# EAGLE design sondeSide (EAGLE 9.1.2)
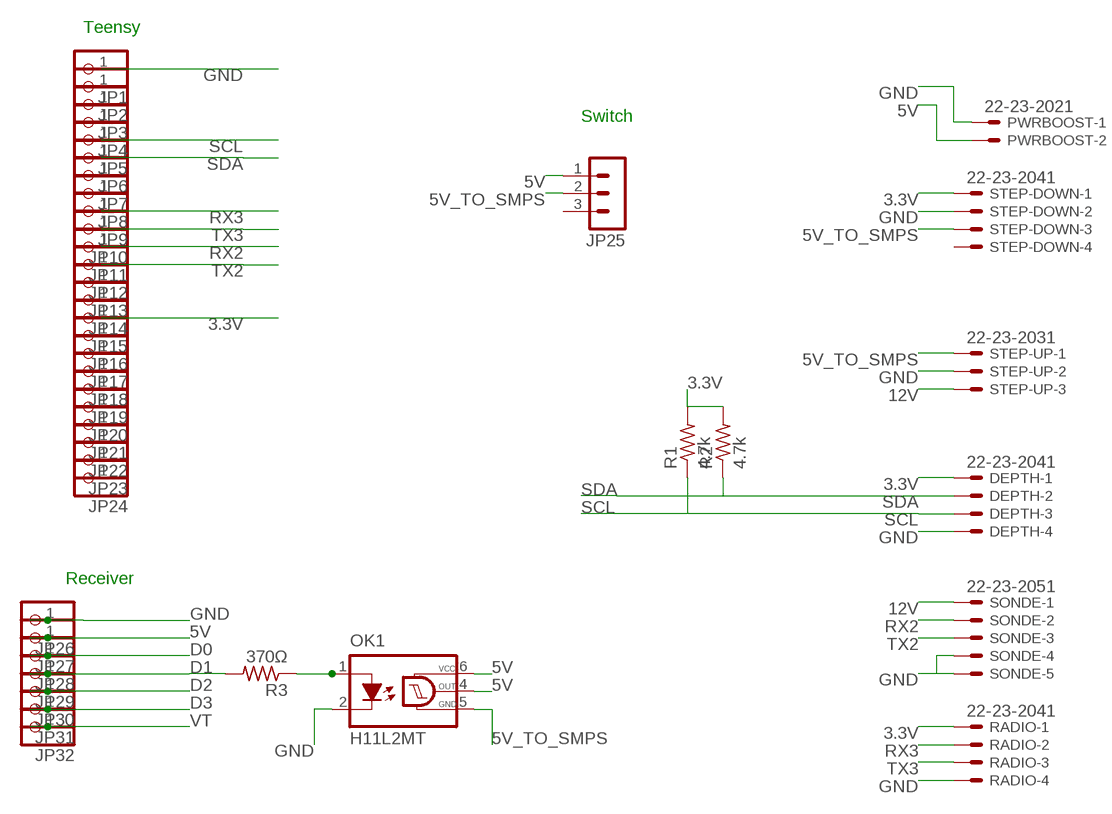
[diagram p0: schematic, sheet 1]

## Parts
DEPTH  22-23-2041  [22-23-2041]
JP1  PINHD-1X1  [1X01]
JP2  PINHD-1X1  [1X01]
JP3  PINHD-1X1  [1X01]
JP4  PINHD-1X1  [1X01]
JP5  PINHD-1X1  [1X01]
JP6  PINHD-1X1  [1X01]
JP7  PINHD-1X1  [1X01]
JP8  PINHD-1X1  [1X01]
JP9  PINHD-1X1  [1X01]
JP10  PINHD-1X1  [1X01]
JP11  PINHD-1X1  [1X01]
JP12  PINHD-1X1  [1X01]
JP13  PINHD-1X1  [1X01]
JP14  PINHD-1X1  [1X01]
JP15  PINHD-1X1  [1X01]
JP16  PINHD-1X1  [1X01]
JP17  PINHD-1X1  [1X01]
JP18  PINHD-1X1  [1X01]
JP19  PINHD-1X1  [1X01]
JP20  PINHD-1X1  [1X01]
JP21  PINHD-1X1  [1X01]
JP22  PINHD-1X1  [1X01]
JP23  PINHD-1X1  [1X01]
JP24  PINHD-1X1  [1X01]
JP25  MA03-1  [MA03-1]
JP26  PINHD-1X1  [1X01]
JP27  PINHD-1X1  [1X01]
JP28  PINHD-1X1  [1X01]
JP29  PINHD-1X1  [1X01]
JP30  PINHD-1X1  [1X01]
JP31  PINHD-1X1  [1X01]
JP32  PINHD-1X1  [1X01]
OK1  H11L2MT  [DIL6-04]
PWRBOOST  22-23-2021  [22-23-2021]
R1  4.7k  R-US_0204/7  [0204/7]
R2  4.7k  R-US_0204/7  [0204/7]
R3  370Ω  R-US_0204/2V  [0204V]
RADIO  22-23-2041  [22-23-2041]
SONDE  22-23-2051  [22-23-2051]
STEP-DOWN  22-23-2041  [22-23-2041]
STEP-UP  22-23-2031  [22-23-2031]

## Nets
3.3V: DEPTH.1 JP15.1 R1.2 R2.2 RADIO.1 STEP-DOWN.1
5V: JP25.1 JP27.1 OK1.4(OUT) OK1.6(VCC) PWRBOOST.2
5V_TO_SMPS: JP25.2 OK1.5(GND) STEP-DOWN.3 STEP-UP.1
12V: SONDE.1 STEP-UP.3
D0: JP28.1
D1: JP29.1 R3.2
D2: JP30.1
D3: JP31.1
GND: DEPTH.4 JP1.1 JP26.1 OK1.2(C) PWRBOOST.1 RADIO.4 SONDE.4 SONDE.5 STEP-DOWN.2 STEP-UP.2
N$1: OK1.1(A) R3.1
RX2: JP11.1 SONDE.2
RX3: JP9.1 RADIO.2
SCL: DEPTH.3 JP5.1 R1.1
SDA: DEPTH.2 JP6.1 R2.1
TX2: JP12.1 SONDE.3
TX3: JP10.1 RADIO.3
VT: JP32.1
Unconnected: JP2.1 JP3.1 JP4.1 JP7.1 JP8.1 JP13.1 JP14.1 JP16.1 JP17.1 JP18.1 JP19.1 JP20.1 JP21.1 JP22.1 JP23.1 JP24.1 JP25.3 STEP-DOWN.4

## Notes on the sheet
- Teensy
- Switch
- Receiver

## Library data of the parts
DEPTH RADIO STEP-DOWN = con-molex:22-23-2041: .100" (2.54mm) Center Header - 4 Pin; MF: MOLEX; MPN: 22-23-2041; OC_FARNELL: 1462920; OC_NEWARK: 38C0355
JP1-JP24 JP26-JP32 = pinhead:PINHD-1X1: PIN HEADER
JP25 = con-lstb:MA03-1: PIN HEADER; OC_FARNELL: unknown; OC_NEWARK: unknown
OK1 = optocoupler:H11L*M: 6-Pin DIP Optocoupler Source: http://www.fairchildsemi.com/ds/H1/H11L2-M.pdf; OC_FARNELL: unknown; OC_NEWARK: unknown
PWRBOOST = con-molex:22-23-2021: .100" (2.54mm) Center Header - 2 Pin; MF: MOLEX; MPN: 22-23-2021; OC_FARNELL: 1462926; OC_NEWARK: 25C3832
R1-R3 = rcl:R-US_: RESISTOR, American symbol; SPICEPREFIX: R
SONDE = con-molex:22-23-2051: .100" (2.54mm) Center Header - 5 Pin; MF: MOLEX; MPN: 22-23-2051; OC_FARNELL: 1462952; OC_NEWARK: 38C9178
STEP-UP = con-molex:22-23-2031: .100" (2.54mm) Center Header - 3 Pin; MF: MOLEX; MPN: 22-23-2031; OC_FARNELL: 1462950; OC_NEWARK: 30C0862

## Board
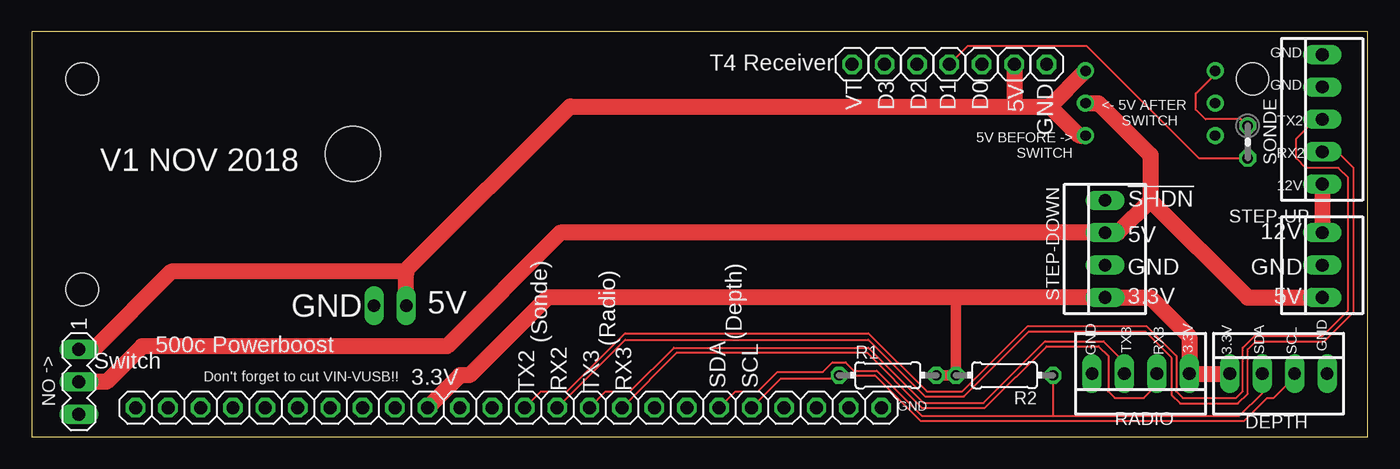
[diagram p1: board, top side]
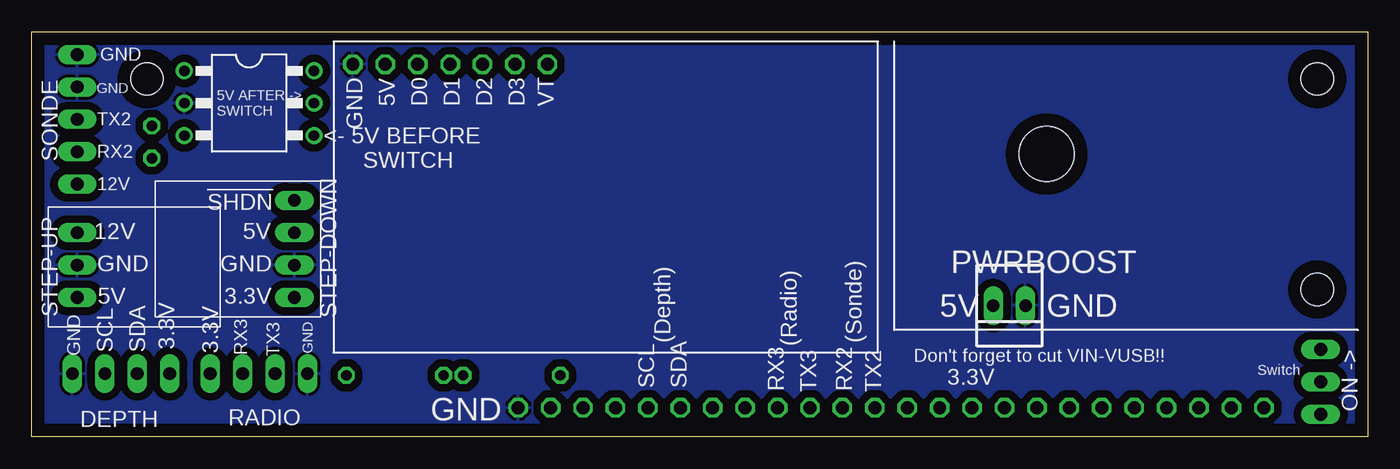
[diagram p2: board, bottom side, seen from below]

Size 104.65 x 31.75 mm. Coordinates in mm from the lower left corner, seen from the top.
Outline: 0,0 104.65,0 104.65,31.75 0,31.75 0,0
Copper layers (1*16): Top 0.035mm / dielectric 1.5mm / Bottom 0.035mm
Design rules "default *": minimum track width 6mil, minimum drill 0.35mm, track to track 8mil, track to pad 6mil, pad to pad 6mil, via to via 6mil, smd to smd 6mil, copper to edge 40mil, drill to drill 10mil, minimum pad ring 10mil, minimum via ring 8mil, stop-mask expansion 4mil, vias tented up to drill 0mil, thermal gap 10mil
Holes 2.54 mm at 3.94,11.56 3.94,28.07 95.63,28.07
Holes 4.32 mm at 25.15,22.17

### Footprints (pad centres in the part's own frame; a part is rotated, then mirrored left to right if it is on the bottom)
22-23-2041 = drill 1 long: 1 -3.81,0; 2 -1.27,0; 3 1.27,0; 4 3.81,0
1X01 = drill 1.016 octagon: 1 0,0
MA03-1 = drill 1.016 long: 1 -2.54,0; 2 0,0; 3 2.54,0
DIL6-04 = drill 0.813: 1 -2.54,-5.08; 2 0,-5.08; 3 2.54,-5.08; 4 2.54,5.08; 5 0,5.08; 6 -2.54,5.08
22-23-2021 = drill 1 long: 1 -1.27,0; 2 1.27,0
0204/7 = drill 0.813 octagon: 1 -3.81,0; 2 3.81,0
0204V = drill 0.813 octagon: 1 -1.27,0; 2 1.27,0
22-23-2051 = drill 1 long: 1 -5.08,0; 2 -2.54,0; 3 0,0; 4 2.54,0; 5 5.08,0
22-23-2031 = drill 1 long: 1 -2.54,0; 2 0,0; 3 2.54,0

### Placement (x,y rotation side)
DEPTH  97.66,4.95 0 top
JP1  66.55,2.29 0 top
JP2  64.01,2.29 0 top
JP3  61.47,2.29 0 top
JP4  58.93,2.29 0 top
JP5  56.39,2.29 0 top
JP6  53.85,2.29 0 top
JP7  51.31,2.29 0 top
JP8  48.77,2.29 0 top
JP9  46.23,2.29 0 top
JP10  43.69,2.29 0 top
JP11  41.15,2.29 0 top
JP12  38.61,2.29 0 top
JP13  36.07,2.29 0 top
JP14  33.53,2.29 0 top
JP15  30.99,2.29 0 top
JP16  28.45,2.29 0 top
JP17  25.91,2.29 0 top
JP18  23.37,2.29 0 top
JP19  20.83,2.29 0 top
JP20  18.29,2.29 0 top
JP21  15.75,2.29 0 top
JP22  13.21,2.29 0 top
JP23  10.67,2.29 0 top
JP24  8.13,2.29 0 top
JP25  3.68,4.32 270 top
JP26  79.5,29.21 270 top
JP27  76.96,29.21 270 top
JP28  74.42,29.21 270 top
JP29  71.88,29.21 270 top
JP30  69.34,29.21 270 top
JP31  66.8,29.21 270 top
JP32  64.26,29.21 270 top
OK1  87.63,26.16 270 bottom
PWRBOOST  28.07,10.29 180 bottom
R1  67.06,4.83 0 top
R2  76.2,4.83 180 top
R3  95.25,23.11 270 top
RADIO  86.87,4.95 180 top
SONDE  101.09,24.89 90 top
STEP-DOWN  84.07,14.73 90 top
STEP-UP  101.09,13.46 90 top

### Tracks (layer width: path | path; a pad name or v marks a point on that pad's centre or on a via)
3.3V
  Top 0.813: 72.39,10.92 R2.2 R1.2
  Top 1.27: DEPTH.1 RADIO.1 90.68,7.87 87.63,10.92 STEP-DOWN.1 72.39,10.92 40.39,10.92 34.29,4.83 33.53,4.83 JP15.1
5V
  Top 1.27: PWRBOOST.2 29.34,12.83 | 77.22,25.91 42.16,25.91 29.34,13.08 29.34,12.83 | 77.22,25.91 79.76,25.91 | JP25.1 4.83,6.86 10.92,12.95 29.34,12.95 29.34,12.83 | JP27.1 76.96,26.16 77.22,25.91 | 79.76,25.91 OK1.6 | OK1.4 82.04,23.62 79.76,25.91
5V_TO_SMPS
  Top 1.27: 87.63,18.54 87.63,22.1 83.57,26.16 OK1.5 | 87.63,18.54 85.09,16 STEP-DOWN.3 41.4,16 32.51,7.11 8.64,7.11 5.84,4.32 JP25.2 | 87.63,18.54 95.25,10.92 STEP-UP.1
12V
  Top 1.27: SONDE.1 STEP-UP.3
D1
  Top 0.152: JP29.1 73.33,30.66 82.63,30.66 91.44,21.84 R3.2
GND
  pour Bottom (isolate 0.61): -1.27,32.51 -1.27,-1.78 0.76,-1.78 105.92,-1.78 105.92,29.46 105.92,32.51
N$1
  Top 0.152: R3.1 94.74,24.89 91.95,24.89 91.19,25.65 91.19,26.92 92.71,28.45 OK1.1
RX2
  Top 0.152: JP11.1 46.48,7.62 65.53,7.62 69.98,3.17 73.03,3.17 78.11,8.26 87.25,8.26 89.28,6.22 89.28,3.3 89.97,2.62 94.49,2.62 95.25,3.38 95.25,6.86 95.89,7.49 101.27,7.49 103.56,9.78 103.56,21.08 102.29,22.35 SONDE.2
RX3
  Top 0.152: JP9.1 50.55,6.6 65.41,6.6 69.72,2.29 74.68,2.29 79.5,7.11 83.57,7.11 84.33,6.35 84.33,3.56 84.84,3.05 87.12,3.05 88.14,4.06 RADIO.2
SCL
  Top 0.152: JP5.1 58.67,4.57 62.99,4.57 R1.1 66.04,4.83 69.6,1.27 95,1.27 96.77,3.05 97.28,3.05 98.93,4.7 DEPTH.3
SDA
  Top 0.152: JP6.1 55.12,3.56 56.9,3.56 58.42,5.08 61.98,5.08 62.74,5.84 63.75,5.84 64.41,5.18 66.19,5.18 69.72,1.65 80.01,1.65 | DEPTH.2 96.39,3.43 94.61,1.65 80.01,1.65 | R2.1 80.01,1.65
TX2
  Top 0.152: JP12.1 39.88,3.56 41.91,3.56 46.48,8.13 65.53,8.13 70.1,3.56 72.9,3.56 78.03,8.69 87.33,8.69 89.66,6.35 89.66,3.56 90.17,3.05 94.36,3.05 94.87,3.56 94.87,6.99 95.81,7.92 101.14,7.92 103.12,9.91 103.12,20.32 102.36,21.08 99.82,21.08 99.06,21.84 99.06,23.37 100.58,24.89 SONDE.3
TX3
  Top 0.152: JP10.1 44.96,3.56 46.86,3.56 50.29,6.99 65.53,6.99 69.85,2.67 74.55,2.67 79.38,7.49 83.95,7.49 85.6,5.84 RADIO.3

### Text on the board
tPlace: Switch
tNames: GND | T4 Receiver | VT | D3 | D2 | D1 | D0 | 5V | GND | GND | 5V BEFORE -> / SWITCH | <- 5V AFTER / SWITCH | TX2 | RX2 | V1 NOV 2018 | 12V | !SHDN | 5V | 12V | GND | GND | 5V | 3.3V | 5V | GND | GND | TX3 | RX3 | 3.3V | 3.3V | SDA | SCL | (Depth) | 500c Powerboost | TX2 | (Sonde) | RX2 | TX3 | (Radio) | RX3 | GND | <- ON | Don't forget to cut VIN-VUSB!! | 3.3V | SDA | SCL | GND
bNames: GND | GND | VT | D3 | D2 | D1 | D0 | 5V | 5V AFTER -> / SWITCH | GND | TX2 | RX2 | SONDE | <- 5V BEFORE / SWITCH | STEP-DOWN | 12V | !SHDN | 12V | STEP-UP | 5V | GND | GND | 3.3V | 5V | 3.3V | GND | 5V | GND | TX3 | RX3 | ON -> | TX2 | (Sonde) | RX2 | TX3 | (Radio) | RX3 | (Depth) | 3.3V | SDA | SCL | Don't forget to cut VIN-VUSB!! | GND | Switch | 3.3V | SDA | SCL | DEPTH | GND | RADIO